# Altium schematic sheet Microcontroller.SchDoc
size 420 x 297 mm; SheetNumber: 2; SheetTotal: 4
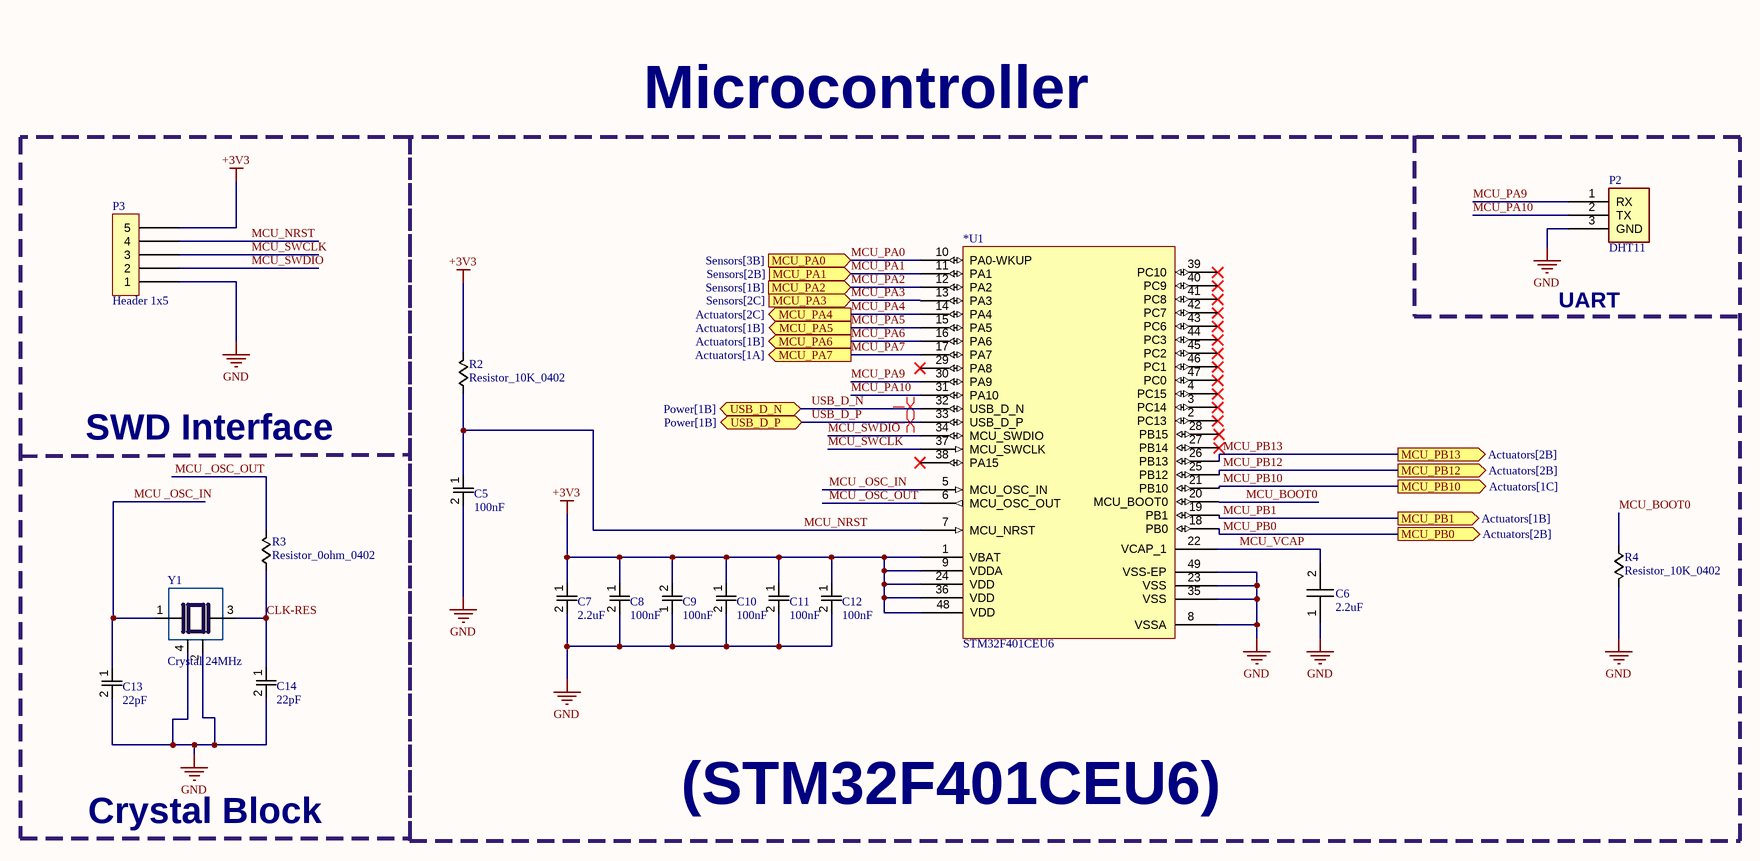
[diagram p0: Microcontroller.SchDoc]

## Parts
*U1  STM32F401CEU6  [UFQFPN-48_7x7mm_P0.5mm]
C5  100nF  [CAPC1005X55N]
C6  2.2uF  [CAPC2012X140N]
C7  2.2uF  [CAPC1005X55N]
C8  100nF  [CAPC1005X55N]
C9  100nF  [CAPC1005X55N]
C10  100nF  [CAPC1005X55N]
C11  100nF  [CAPC1005X55N]
C12  100nF  [CAPC1005X55N]
C13  22pF  [CAPC1005X55N]
C14  22pF  [CAPC1005X55N]
P2  DHT11  [HEADER 1x3 MALE]
P3  Header 1x5  [Header 1x5 male]
R2  Resistor_10K_0402  [RESC1005X40N]
R3  Resistor_0ohm_0402  [RESC1005X40N]
R4  Resistor_10K_0402  [RESC1005X40N]
Y1  Crystal 24MHz  [XTAL_C7S-24.000-12-3030-X-R]

## Blocks framed on the sheet
(STM32F401CEU6): *U1 C5-C12 P2 R2 R4

## Ports
MCU_PA0 (in, see Sensors[3B]), MCU_PA1 (in, see Sensors[2B]), MCU_PA2 (in, see Sensors[1B]), MCU_PA3 (in, see Sensors[2C]), MCU_PA4 (out, see Actuators[2C]), MCU_PA5 (out, see Actuators[1B]), MCU_PA6 (out, see Actuators[1B]), MCU_PA7 (out, see Actuators[1A]), MCU_PB0 (out, see Actuators[2B]), MCU_PB1 (out, see Actuators[1B]), MCU_PB10 (out, see Actuators[1C]), MCU_PB12 (out, see Actuators[2B]), MCU_PB13 (out, see Actuators[2B]), USB_D_N (bidir, see Power[1B]), USB_D_P (bidir, see Power[1B])

## Nets
+3V3: *U1.1(VBAT) *U1.9(VDDA) *U1.24(VDD) *U1.36(VDD) *U1.48(VDD) C7.1 C8.1 C9.2 C10.1 C11.1 C12.1 P3.5 R2.2
GND: *U1.8(VSSA) *U1.23(VSS) *U1.35(VSS) *U1.49(VSS-EP) C5.2 C6.1 C7.2 C8.2 C9.1 C10.2 C11.2 C12.2 C13.2 C14.2 P2.3(GND) P3.1 R4.2 Y1.2 Y1.4
CLK-RES: C14.1 R3.1 Y1.3
MCU _OSC_IN: *U1.5(MCU_OSC_IN) C13.1 Y1.1
MCU _OSC_OUT: *U1.6(MCU_OSC_OUT) R3.2
MCU_BOOT0: *U1.20(MCU_BOOT0) R4.1
MCU_NRST: *U1.7(MCU_NRST) C5.1 P3.4 R2.1
MCU_PA0: *U1.10(PA0-WKUP) ; port MCU_PA0
MCU_PA1: *U1.11(PA1) ; port MCU_PA1
MCU_PA2: *U1.12(PA2) ; port MCU_PA2
MCU_PA3: *U1.13(PA3) ; port MCU_PA3
MCU_PA4: *U1.14(PA4) ; port MCU_PA4
MCU_PA5: *U1.15(PA5) ; port MCU_PA5
MCU_PA6: *U1.16(PA6) ; port MCU_PA6
MCU_PA7: *U1.17(PA7) ; port MCU_PA7
MCU_PA9: *U1.30(PA9) P2.1(RX)
MCU_PA10: *U1.31(PA10) P2.2(TX)
MCU_PB0: *U1.18(PB0) ; port MCU_PB0
MCU_PB1: *U1.19(PB1) ; port MCU_PB1
MCU_PB10: *U1.21(PB10) ; port MCU_PB10
MCU_PB12: *U1.25(PB12) ; port MCU_PB12
MCU_PB13: *U1.26(PB13) ; port MCU_PB13
MCU_SWCLK: *U1.37(MCU_SWCLK) P3.3
MCU_SWDIO: *U1.34(MCU_SWDIO) P3.2
MCU_VCAP: *U1.22(VCAP_1) C6.2
USB_D_N: *U1.32(USB_D_N) ; port USB_D_N
USB_D_P: *U1.33(USB_D_P) ; port USB_D_P

Not connected (* = marked no-connect by the designer): *U1 2(PC13)* 3(PC14)* 4(PC15)* 27(PB14)* 28(PB15)* 29(PA8)* 38(PA15)* 39(PC10)* 40(PC9)* 41(PC8)* 42(PC7)* 43(PC6)* 44(PC3)* 45(PC2)* 46(PC1)* 47(PC0)*

## Layout directives
differential pair: (no net found under the mark), USB_D_P

## Notes on the sheet
- Microcontroller
- UART
- SWD Interface
- Crystal Block
- THIS DOCUMENT AND THE DATA DISCLOSED HEREIN OR
- HEREWITH IS THE PROPERTY OF ALTIUM LIMITED AND MAY
- DWG NO:
- REVISION
- REV:
- DESCRIPTION
- DATE
- APPROVED
- BE FREELY DISTRIBUTED IN WHOLE. NO RIGHTS ARE
- RESERVED OR EXPRESS OR IMPLIED WARANTEE GIVEN.
- ENG:
- APPROVALS
- PROJECT
- DSN:
- CHK:
- REFERENCE DOCUMENTS
- PROJECT REVISION:
- TITLE
- DOCUMENT REVISION:
- DESIGN ITEM:
- BOM:
- FAB DWG:
- PCB DWG:
- ASSY DWG:
- SCALE:
- A3
- SIZE
- CAGE CODE
- FILE NAME
- DWG NO.
- SHEET
- OF
- REV

## Library data of the parts
*U1 = STM32F401CEU6: ARM Cortex-M4 32b MCU+FPU,105DMIPS,512KB Flash/96KB RAM, 11 TIMs, 1 ADC, 11 comm. interfaces; Manufacturer: ST; Manufacturer Part#: STM32F401CEU6; Supplier: LCSC; Supplier Part#: C60420; ComponentLink1Description: Data Sheet; ComponentLink1URL: https://www.lcsc.com/datasheet/C60420.pdf?spm=wm.sxq.inf.ggs___wm.fly.bg.0.stp&lcsc_vid=E1QPAlFSFlQNAwEAEQJdBlJfE1hWVlFUQlIPUgAERAIxVlNeQFNcV1NSTlNaUDsOAxUeFF5JWBYZEEoKFBINSQcJGk4%3D
C5 C8-C12 = Cap_100nF_0402: CAP CER 100nF 16V X7R 0402; Manufacturer: Samsung Electro-Mechanics; Manufacturer Part #: CL05B104KO5NNNC; Supplier: LCSC; Supplier Part#: C1525; ComponentLink1Description: Data Sheet; ComponentLink1URL: https://www.lcsc.com/datasheet/C1525.pdf?spm=wm.sxq.inf.ggs___wm.fly.bg.1.stp&lcsc_vid=T1MKV1cAE1gLBAVfTgIKUgJfTlkPBQBVQlMMBAJURwAxVlNeT1dfVlxVQ1ReXzsOAxUeFF5JWBYZEEoKFBINSQcJGk4%3D
C6 = Cap_0805_2u2F: CAP CER 2.2uF 16V X7R 0805; Manufacturer: Samsung Electro-Mechanics; Manufacturer Part#: CL21B225KOFNNNE; Supplier: LCSC; Supplier Part#: C28234; ComponentLink1Description: Data Sheet; ComponentLink1URL: https://www.lcsc.com/datasheet/C28234.pdf?spm=wm.sxq.inf.ggs___wm.fly.bg.7.stp&lcsc_vid=RlgPBF0EEVEPX1ZVRAVZVwcHRVJaBVJSTlNXAgBWFlkxVlNeQFFbX1RVRFRaVTsOAxUeFF5JWBYZEEoBGA4JCwFIFA4DSA%3D%3D
C7 = Cap_2.2uF_0402: CAP CER 2.2uF 16V X5R 0402; Manufacturer: Samsung Electro-Mechanics; Manufacturer Part #: CL05A225KO5NQNC; Supplier: LCSC; Supplier Part#: C170151; ComponentLink1Description: Data Sheet; ComponentLink1URL: https://www.lcsc.com/datasheet/C170151.pdf?spm=wm.sxq.inf.ggs___wm.fly.bg.3.stp&lcsc_vid=T1MKV1cAE1gLBAVfTgIKUgJfTlkPBQBVQlMMBAJURwAxVlNeT1dfVlxVQ1ReXzsOAxUeFF5JWBYZEEoKFBINSQcJGk4%3D
C13 C14 = Cap_22pF_0402: CAP CER 22pF 50V NP0 0402; Manufacturer: YAGEO; Manufacturer Part #: CC0402JRNPO9BN220; Supplier: LCSC; Supplier Part#: C106203; ComponentLink1Description: Data Sheet; ComponentLink1URL: https://www.lcsc.com/datasheet/C106203.pdf?spm=wm.sxq.inf.ggs___wm.fly.bg.0.stp&lcsc_vid=RFgKVFNTRgJeV1xfTlldBAVTQANbU1dQTgBXBVEDElgxVlNeT1ZZU1VQQ1ZZXztW
P2 = UART: ComponentLink1Description: Link
R2 R4 = Resistor_10K_0402: RES 10kΩ ±1% 62.5mW 0402; Manufacturer: YAGEO; Manufacturer Part #: RC0402FR-0710KL; Supplier: LCSC; Supplier Part #: C60490; ComponentLink1Description: Data Sheet; ComponentLink1URL: https://www.lcsc.com/datasheet/C60490.pdf?spm=wm.sxq.inf.ggs___wm.fly.bg.1.stp&lcsc_vid=T1MKV1cAE1gLBAVfTgIKUgJfTlkPBQBVQlMMBAJURwAxVlNeT1dcVVBSRVlfUDsOAxUeFF5JWBYZEEoKFBINSQcJGk4NBhADEA4cHktXRlhXSQwSGg0%3D
R3 = Resistor_0ohm_0402: RES 0Ω 0.1W 0402; Manufacturer: PANASONIC; Manufacturer Part #: ERJ2GE0R00X; Supplier: LCSC; Supplier Part #: C242160; ComponentLink1Description: Data Sheet; ComponentLink1URL: https://www.lcsc.com/datasheet/C242160.pdf?spm=wm.sxq.inf.ggs___wm.fly.bg.1.stp&lcsc_vid=T1MKV1cAE1gLBAVfTgIKUgJfTlkPBQBVQlMMBAJURwAxVlNeT1dcVF1TR1RYVzsOAxUeFF5JWBYZEEoKFBINSQcJGk4NBhADEA4cHktXRlhXSQwSGg0%3D
Y1 = Crystal 24MHz: YXC Crystal Oscillators XL7EL89CKI-111YLC-24M; Manufacturer Part#: SMD2016-4P; Manufacturer: YXC Crystal Oscillators; Supplier: LCSC; Supplier Part#: C2965580; ComponentLink1Description: Data Sheet; ComponentLink1URL: https://www.lcsc.com/datasheet/C2965580.pdf?spm=wm.sxq.inf.ggs___wm.fly.bg.0.stp&lcsc_vid=EVYPBVRQTlZbUwYCRFgKAVAHE1INAl1VRwJdBFRRElcxVlNeQFNdUFxSTldXXjsOAxUeFF5JWBYZEEoKFBINSQcJGk4dAgUUFAk%3D